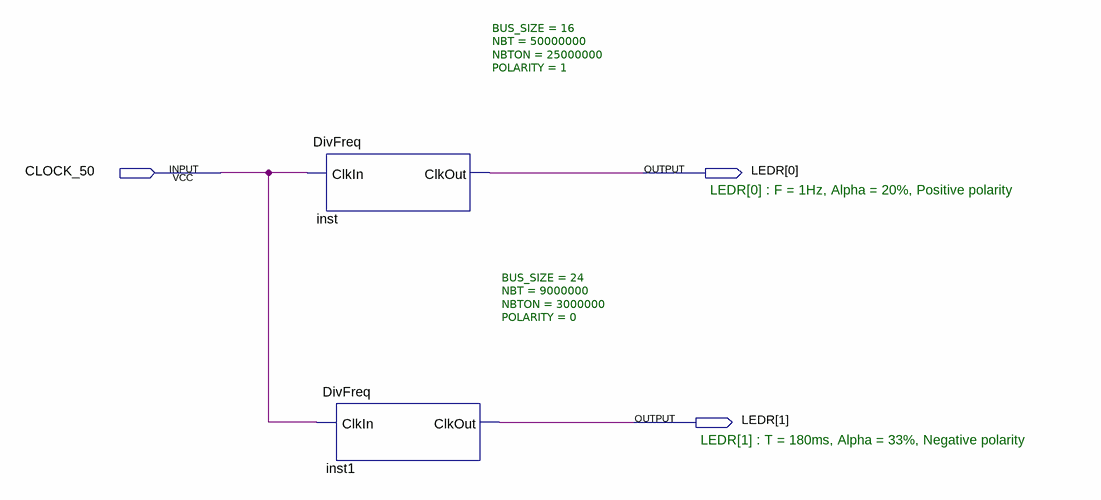
[diagram p0: schematic sheet]
// Quartus schematic test_DivFreq_DE2_115.bdf as structural Verilog: 2 symbols, 3 pins
module test_DivFreq_DE2_115 (
  input  CLOCK_50,
  output [1:0] LEDR
);

  DivFreq #(.BUS_SIZE(16), .NBT(50000000), .NBTON(25000000), .POLARITY(1)) inst (.ClkIn(CLOCK_50), .ClkOut(LEDR[0]));
  DivFreq #(.BUS_SIZE(24), .NBT(9000000), .NBTON(3000000), .POLARITY(0)) inst1 (.ClkIn(CLOCK_50), .ClkOut(LEDR[1]));

  // Notes on the sheet:
  //   LEDR[0] : F = 1Hz, Alpha = 20%, Positive polarity
  //   LEDR[1] : T = 180ms, Alpha = 33%, Negative polarity
endmodule
